# EasyEDA Pro project Buck.eprj

# Schematic Esquematico Buck
Board Name: BUCK; Create Date: 2025-07-01; Page Name: P1; Project Name: Buck; Schematic Name: Esquematico Buck; Update Date: 2025-07-13; Company: EasyEDA.com; Page Size: A4; Version: V1.0
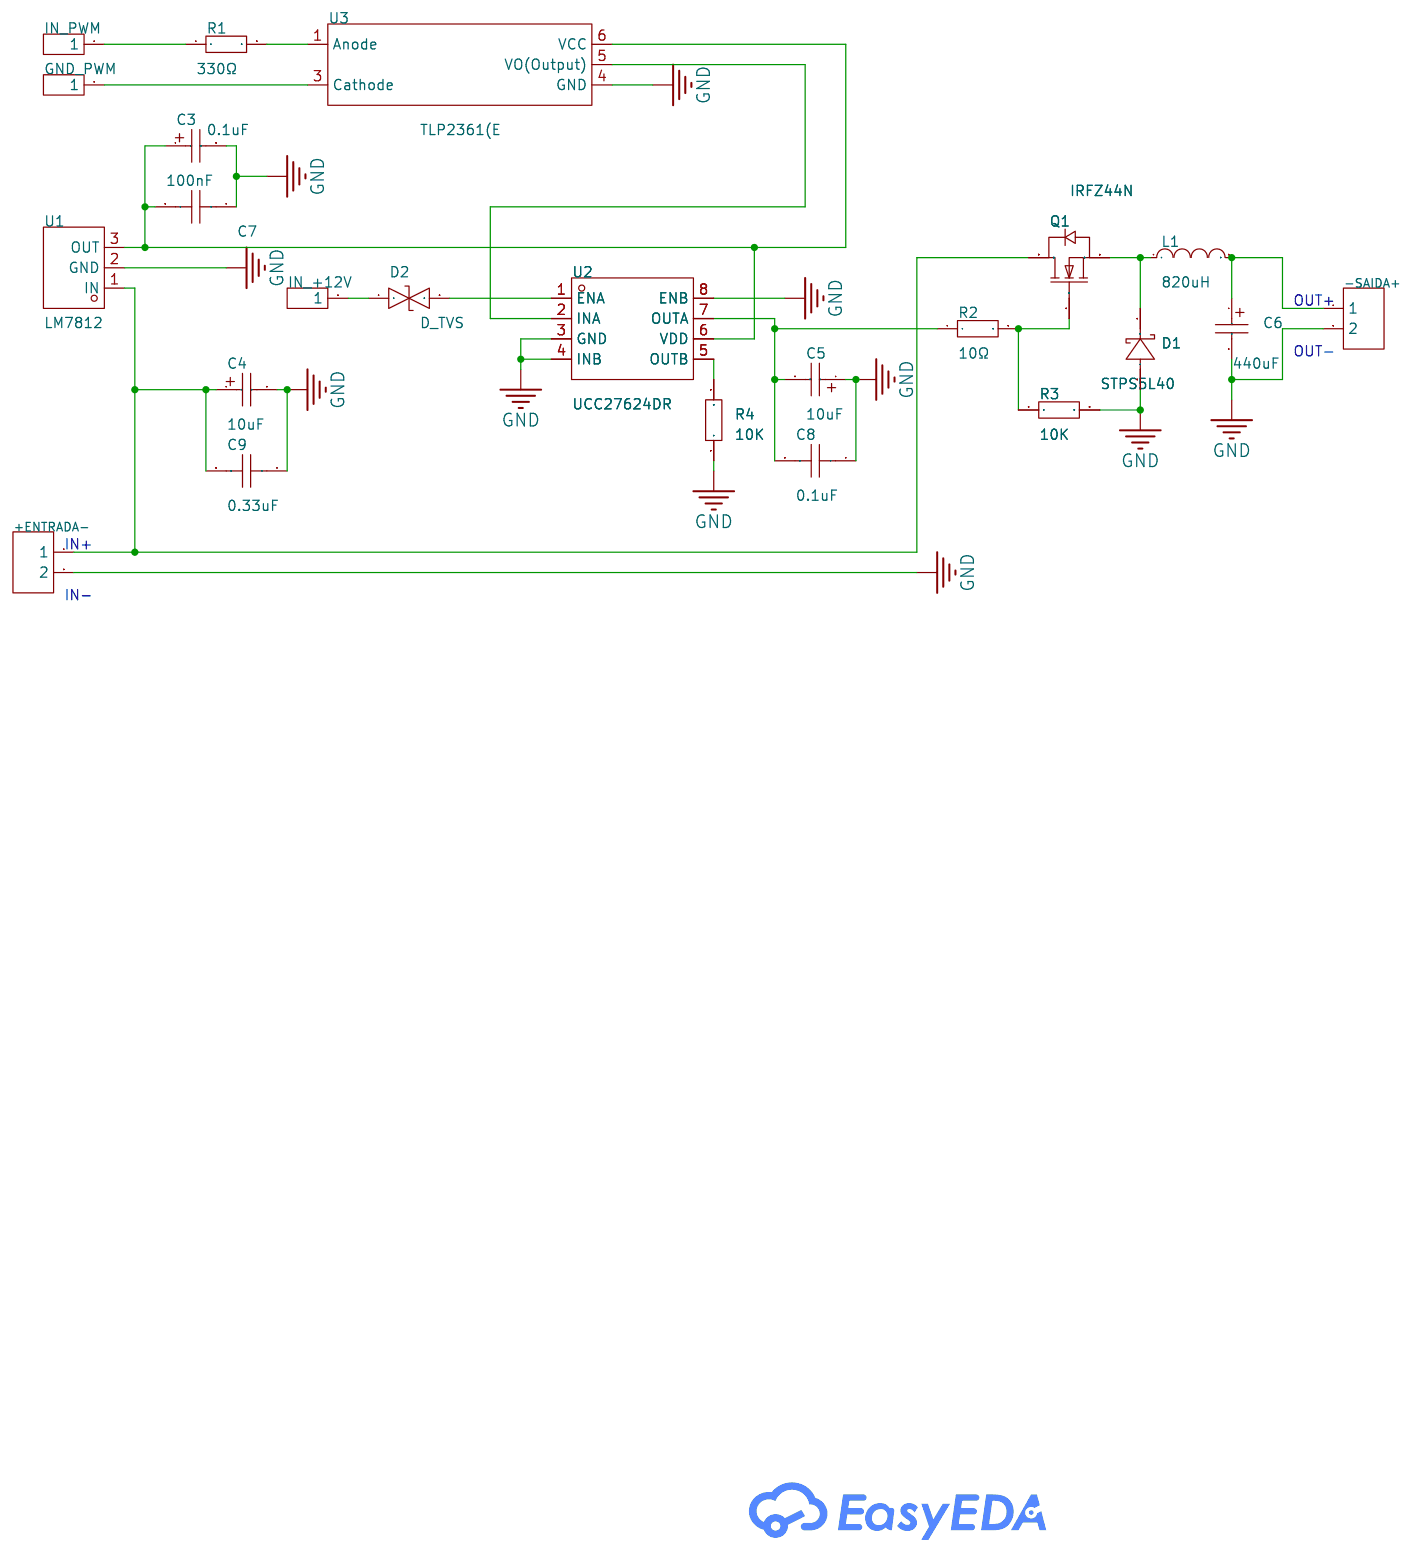
[diagram p0: schematic sheet]

## Parts
+ENTRADA-  -  [HDR-TH_2P-P2.54-V-F]
-SAIDA+  -  [HDR-TH_2P-P2.54-V-F]
C3  0.1uF  [CAP-SMD_BD3.0-L3.3-W3.3-RD]
C4  10uF  [CAP-SMD_BD3.0-L3.3-W3.3-RD]
C5  10uF  [CAP-SMD_BD3.0-L3.3-W3.3-RD]
C6  440uF  [CAP-SMD_BD3.0-L3.3-W3.3-RD]
C7  100nF  [C0201]
C8  0.1uF  [C0201]
C9  0.33uF  [C0201]
D1  STPS5L40  [DO-201AD_BD5.3-L9.5-P13.50-D1.4-RD]
D2  D_TVS  [SMB_L4.6-W3.6-LS5.3-BI]
GND_PWM  -  [HDR-TH_1P-V-M_XKB_X4611WV-01I-C28D40]
IN_+12V  -  [HDR-TH_1P-V-M_XKB_X4611WV-01I-C28D40]
IN_PWM  -  [HDR-TH_1P-V-M_XKB_X4611WV-01I-C28D40]
L1  820uH  [L1206]
Q1  IRFZ44N  [TO-220-3_L9.9-W4.5-P2.54-L]
R1  330 Ω  [R0603]
R2  10 Ω  [R0603]
R3  10K  [R0603]
R4  10K  [R0603]
U1  LM7812  [TO-263-3_L10.1-W9.0-P5.08-LS15.2-TL]
U2  UCC27624DR  [SOIC-8_L4.9-W3.9-P1.27-LS5.9-BL]
U3  TLP2361(E  [OPTO-SMD-5_L3.7-W4.6-P1.27-LS7.0-BR]

## Library data of the parts
+ENTRADA- -SAIDA+ = HDR-F_2.54_1x2P: Supplier Footprint: Through
C3-C6 = C_Ele_SMD_3x5.4mm: Supplier Footprint: SMD,3x5.4mm
C7-C9 = CAP_0201: Supplier Footprint: 0201
D1 = STPS5L40: LCSC Part Name: 电压:40V 电流:5A; Supplier Part: C2965232; Manufacturer: ST(意法半导体); Supplier Footprint: DO-201AD; JLCPCB Part Class: Extended Part; Datasheet: https://atta.szlcsc.com/upload/public/pdf/source/20191219/C472557_8126688719F2AFD7F9146EBFAB7586BB.pdf; Supplier: LCSC; Forward Voltage (Vf@If): 500mV@5A; Reverse Voltage (Vr): 40V; Rectified Current: 5A; Reverse Leakage Current (Ir): 200uA@40V
D2 = SMBJ36CA_C556189: LCSC Part Name: SMBJ36CA; Supplier Part: C556189; Manufacturer: Slkor(萨科微); Supplier Footprint: SMB(DO-214AA); JLCPCB Part Class: Extended Part; Datasheet: https://atta.szlcsc.com/upload/public/pdf/source/20200521/C556182_36C917246015907E450C16258F91715F.pdf; Supplier: LCSC; Reverse Stand-Off Voltage (Vrwm): 36V; Maximum Clamping Voltage: 58.1V; Peak Pulse Current (Ipp): 10.3A; Breakdown Voltage: 40V; Reverse Leakage Current (Ir): 5uA; Type: TVS
GND_PWM IN_+12V IN_PWM = HDR-M_2.54_1x1P: Supplier Footprint: Through
L1 = L_1206
Q1 = IRFZ44N: LCSC Part Name: 1个N沟道 耐压:60V 电流:60A; Supplier Part: C7429904; Manufacturer: minos(迈诺斯); Supplier Footprint: TO-220; JLCPCB Part Class: Extended Part; Datasheet: https://atta.szlcsc.com/upload/public/pdf/source/20240924/DFAFBF9B70D3F8B82D3192015D71E054.pdf; Supplier: LCSC; Number: 1 N-Channel; Drain to Source Voltage: 60V; Current - Continuous Drain(Id): 60A; RDS(on): 12mΩ@10V,25A; Pd - Power Dissipation: 87W; Gate Threshold Voltage (Vgs(th)@Id): 3V; Gate Charge(Qg): 31nC@10V; Input Capacitance(Ciss): 910pF@25V; Reverse Transfer Capacitance (Crss@Vds): 30pF@25V; Operating Temperature: -55℃~+175℃@(Tj)
R1-R4 = Res_0603: Supplier Footprint: 0603
U1 = LM7812: Supplier Part: C41366919; Manufacturer: YONGYUTAI(永裕泰); Supplier Footprint: TO-263; Datasheet: https://atta.szlcsc.com/upload/public/pdf/source/20240822/B1FEB2A08D0819A571124BFA06475AD1.pdf; Supplier: LCSC
U2 = UCC27624DR: Supplier Part: C3655293; Manufacturer: TI(德州仪器); Supplier Footprint: SOIC-8; JLCPCB Part Class: Extended Part; Datasheet: https://www.ti.com/cn/lit/gpn/ucc27624; Supplier: LCSC; Driven Configuration: Low Edge; Load Type: MOSFET; Number of Drivers: 2; Peak Output Current(sink): 5A; Peak Output Current(source): 5A; Supply Voltage: 4.5V~26V; Rise Time: 6ns; Fall Time: 10ns; Operating Temperature: -40℃~+150℃@(Tj)
U3 = TLP2361(E: Supplier Part: C6285467; Manufacturer: TOSHIBA(东芝); Supplier Footprint: SO-6,5LEAD; JLCPCB Part Class: Extended Part; Datasheet: https://atta.szlcsc.com/upload/public/pdf/source/20171211/C123773_15129612453461174243.pdf; Supplier: LCSC

## Nets
GND: +ENTRADA-.2 -SAIDA+.2 C3.2 C4.2 C5.1 C6.2 C7.1 C8.1 C9.1 D1.2(A) R3.2 R4.1 U1.2(GND) U2.3(GND) U2.4(INB) U2.8(ENB) U3.4(GND)
$1N479: -SAIDA+.1 C6.1 L1.2
$1N485: D1.1(C) L1.1 Q1.3(S)
$1N1360: U2.2(INA) U3.5(VO(Output))
$1N2621: R1.2 U3.1(Anode)
$1N2625: IN_PWM.1 R1.1
$1N3295: Q1.1(G) R2.2 R3.1
$1N3587: C3.1 C7.2 U1.3(OUT) U2.6(VDD) U3.6(VCC)
$1N3889: D2.2 U2.1(ENA)
$1N3901: D2.1 IN_+12V.1
$1N4438: +ENTRADA-.1 C4.1 C9.2 Q1.2(D) U1.1(IN)
$1N4462: C5.2 C8.2 R2.1 U2.7(OUTA)
$1N5931: R4.2 U2.5(OUTB)
Net-(GND_PWM-1): GND_PWM.1 U3.3(Cathode)

## Notes on the sheet
- OUT+
- OUT-
- IN+
- IN-

# Board PCB1
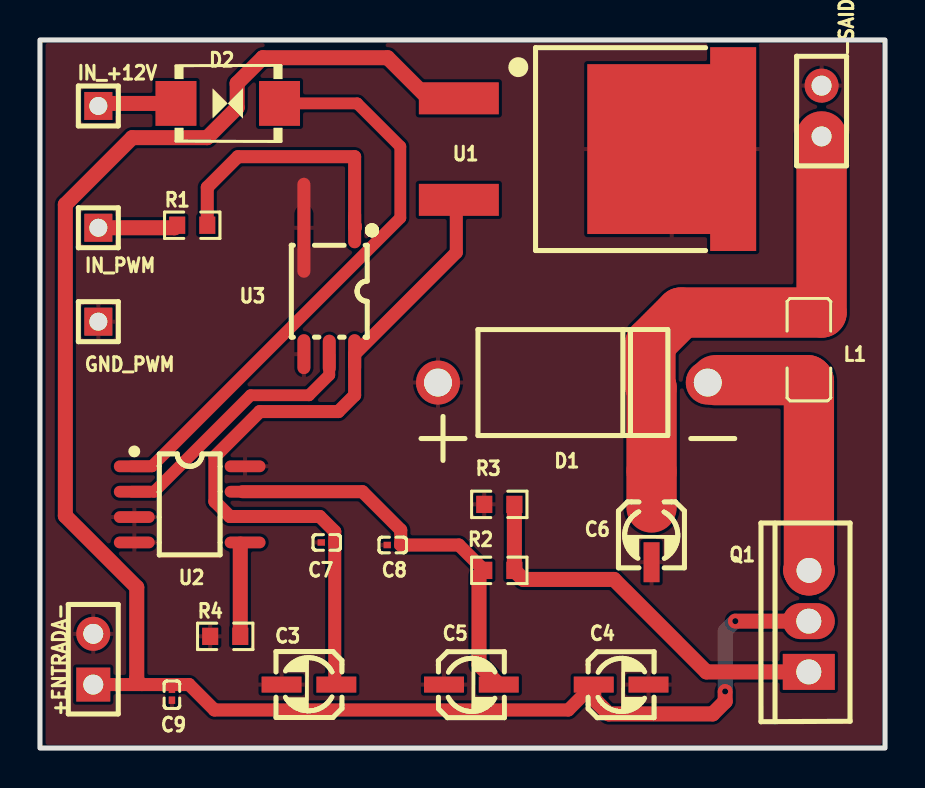
[diagram p1: board, top side]
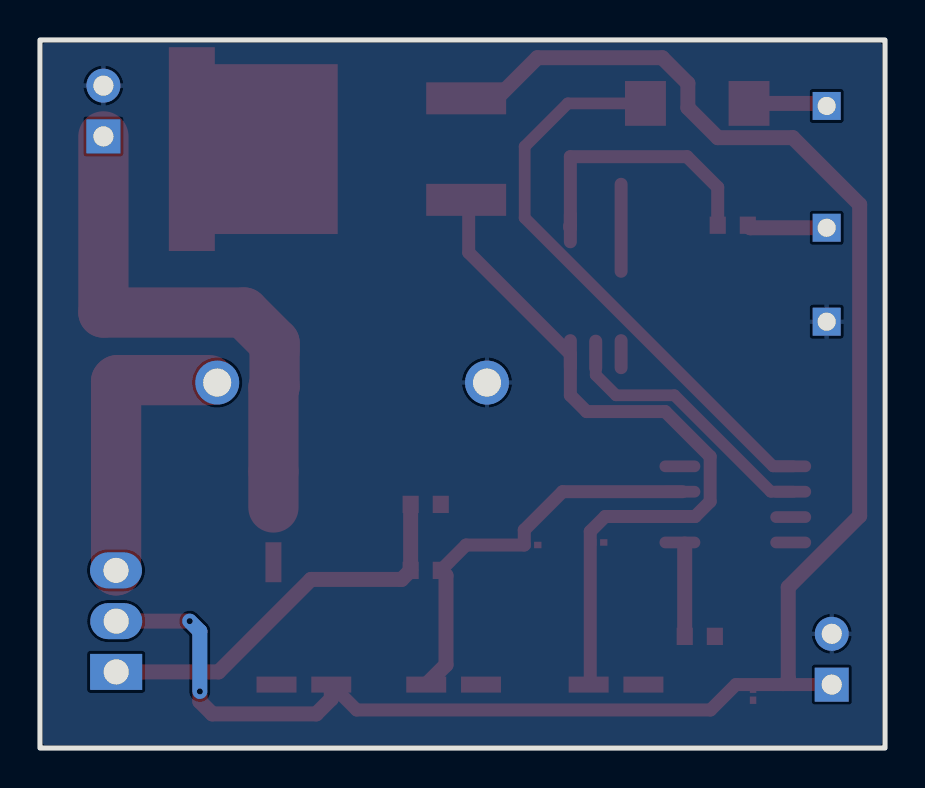
[diagram p2: board, bottom side, seen from below]

Outline 42.29 x 35.43 mm; copper layers: Top Layer, Bottom Layer. Coordinates in mm from the lower left corner of the outline.
Outline path: rectangle 0,35.43 42.29,0
Stack: Top Layer 0.035mm / Dielectric1 1.51mm FR4 er 4.5 / Bottom Layer 0.035mm

## Design rules (mm)
template: Custom Config
spacing copperThickness1oz (default): track to track 0.102, other pairs 0.152 to 0.3
spacing copperThickness2oz: track to track 0.203, other pairs 0.152 to 0.3
track width copperThickness1oz (default): min 0.254, default 0.75, max 2.54
track width copperThickness2oz: min 0.203, default 0.254, max 2.54
differential pair differentialPair (default): width min 0.127, default 0.254, max 2.54; gap min 0.152, default 0.152
via viaSize (default): diameter min 0.5, default 0.61, max 10; hole min 0.3, default 0.305, max 6.3

## Placement (name value [footprint] x y rotation side)
+ENTRADA-  -  [HDR-TH_2P-P2.54-V-F]  2.67 4.44 90 top
-SAIDA+  -  [HDR-TH_2P-P2.54-V-F]  39.12 31.88 90 top
C3  0.1uF  [CAP-SMD_BD3.0-L3.3-W3.3-RD]  13.46 3.17 0 top
C4  10uF  [CAP-SMD_BD3.0-L3.3-W3.3-RD]  29.08 3.17 180 top
C5  10uF  [CAP-SMD_BD3.0-L3.3-W3.3-RD]  21.59 3.17 180 top
C6  440uF  [CAP-SMD_BD3.0-L3.3-W3.3-RD]  30.61 10.67 90 top
C7  100nF  [C0201]  14.35 10.29 0 top
C8  0.1uF  [C0201]  17.65 10.16 0 top
C9  0.33uF  [C0201]  6.6 2.67 90 top
D1  STPS5L40  [DO-201AD_BD5.3-L9.5-P13.50-D1.4-RD]  26.67 18.29 180 top
D2  D_TVS  [SMB_L4.6-W3.6-LS5.3-BI]  9.4 32.26 0 top
GND_PWM  -  [HDR-TH_1P-V-M_XKB_X4611WV-01I-C28D40]  2.92 21.34 0 top
IN_+12V  -  [HDR-TH_1P-V-M_XKB_X4611WV-01I-C28D40]  2.92 32.13 0 top
IN_PWM  -  [HDR-TH_1P-V-M_XKB_X4611WV-01I-C28D40]  2.92 26.03 0 top
L1  820uH  [L1206]  38.48 19.94 90 top
Q1  IRFZ44N  [TO-220-3_L9.9-W4.5-P2.54-L]  38.48 6.35 90 top
R1  330 Ω  [R0603]  7.62 26.16 0 top
R2  10 Ω  [R0603]  22.99 8.89 0 top
R3  10K  [R0603]  22.99 12.19 180 top
R4  10K  [R0603]  9.27 5.59 0 top
U1  LM7812  [TO-263-3_L10.1-W9.0-P5.08-LS15.2-TL]  26.29 29.97 0 top
U2  UCC27624DR  [SOIC-8_L4.9-W3.9-P1.27-LS5.9-BL]  7.49 12.19 270 top
U3  TLP2361(E  [OPTO-SMD-5_L3.7-W4.6-P1.27-LS7.0-BR]  14.48 22.86 90 top

## Footprints (pads in the part's own frame, mm; a bottom-side part is the same pattern mirrored in y, then rotated)
C0201
  rect 0.368x0.324 smd: 1(-0.275,0) 2(0.275,0)
CAP-SMD_BD3.0-L3.3-W3.3-RD
  rect 2x0.8 smd: 1(1.37,0) 2(-1.37,0)
DO-201AD_BD5.3-L9.5-P13.50-D1.4-RD
  round 2.2 hole 1.4: 1(-6.75,0) 2(6.75,0)
HDR-TH_1P-V-M_XKB_X4611WV-01I-C28D40
  rect 1.4x1.4 hole 0.9: 1(0,0)
HDR-TH_2P-P2.54-V-F
  rect 1.7x1.7 hole 1: 1(-1.27,0)
  round 1.7 hole 1: 2(1.27,0)
L1206
  rect 1.485x1.728 smd: 1(-1.593,0) 2(1.593,0)
OPTO-SMD-5_L3.7-W4.6-P1.27-LS7.0-BR
  oval 2x0.65 smd: 1(3.15,-1.27) 4(-3.15,1.27) 5(-3.175,0) 6(-3.15,-1.27)
  oval 5x0.65 smd: 3(3.175,1.27)
R0603
  rect 0.806x0.864 smd: 1(-0.753,0) 2(0.753,0)
SMB_L4.6-W3.6-LS5.3-BI
  rect 2.047x2.241 smd: 1(-2.591,0) 2(2.591,0)
SOIC-8_L4.9-W3.9-P1.27-LS5.9-BL
  oval 0.588x2.045 smd: 1(-1.905,-2.772) 2(-0.635,-2.772) 3(0.635,-2.772) 4(1.905,-2.772) 5(1.905,2.772) 6(0.635,2.772) 7(-0.635,2.772) 8(-1.905,2.772)
TO-220-3_L9.9-W4.5-P2.54-L
  rect 1.8x2.6 hole 1.25: 1(-2.54,0.005)
  oval 1.8x2.6 hole 1.25: 2(0,0.005) 3(2.54,-0.005)
TO-263-3_L10.1-W9.0-P5.08-LS15.2-TL
  rect 4x1.6 smd: 1(-5.327,2.54) 3(-5.327,-2.54)
  custom 8.45x10.2 smd: 2(5.327,0)

## Nets
As in the schematic, except:
GND: +ENTRADA-.2 -SAIDA+.2 C3.2 C4.2 C5.1 C6.2 C7.1 C8.1 C9.1 D1.2 GND_PWM.1 R3.2 R4.1 U1.2 U2.3 U2.4 U2.8 U3.3 U3.4

## Via types
v1: diameter 0.61, hole 0.305, Top Layer to Bottom Layer, 2 vias

## Routing (per net, layer and track width the routed paths; a pad name or vN(x,y) marks a point on that pad's centre or on a via; arc(x,y) is an arc through that point)
$1N479: length 34.1
  Top Layer w0.75: C6.1 30.62,12.05 30.61,13.84 30.57,18.08 30.55,19.89
  Top Layer w2.514: 30.55,19.89 30.55,18.09 30.61,18.04 C6.1
  Top Layer w2.515: -SAIDA+.1 39.12,21.79 32.08,21.79 30.55,20.26 30.55,19.89
$1N485: length 14.2
  Top Layer w2.515: Q1.3 38.48,8.89 L1.1 38.42,18.41 33.81,18.41
$1N1360: length 13.3
  Top Layer w0.588: 14.48,19.68 14.48,18.67 13.46,17.65 10.54,17.65 5.71,12.83 4.59,12.83
$1N2621: length 13.5
  Top Layer w0.65: R1.2 8.37,28.06 9.91,29.59 15.75,29.59 15.75,26.16 15.77,26.14 15.77,26.03 U3.1
$1N2625: length 4
  Top Layer w0.75: IN_PWM.1 6.74,26.03 R1.1
$1N3295: length 20.2
  Top Layer w0.75: R3.1 R2.2 24.19,8.44 28.73,8.44 33.35,3.81 38.35,3.81 38.48,3.94
$1N3587: length 36.8
  Top Layer w0.324: 10.17,11.59 10.14,11.56
  Top Layer w0.65: C3.1 14.75,3.25 14.75,10.84 14,11.59 9.5,11.59 8.75,12.34 8.75,14.59 11,16.84 14.93,16.84 15.75,17.65 U3.6 20.83,24.8 20.83,27.43
$1N3889: length 29.1
  Top Layer w0.588: D2.2 15.88,32.26 18.03,30.1 18.03,26.53 5.6,14.1 4.59,14.1
$1N3901: length 4.2
  Top Layer w0.75: D2.1 2.92,32.26 2.79,32.13 IN_+12V.1
$1N4438: length 91.7
  Top Layer w0.65: 5.1,3.17 +ENTRADA-.1 ; 5.1,3.17 5.1,3.18 4.79,3.49 4.84,3.54 ; 5.1,3.17 7.46,3.17 8.73,1.9 26.44,1.9 C4.1
  Top Layer w0.75: 4.84,3.54 4.84,8.04 1.27,11.62 1.27,27.2 4.62,30.54 8.37,30.54 9.87,32.04 9.87,33.26 11.15,34.54 17.4,34.54 19.43,32.51 20.83,32.51 ; v1(34.29,2.83) 34.29,2.33 33.67,1.71 28.46,1.71 27.71,2.46 C4.1 ; v1(34.8,6.35) Q1.2
  Bottom Layer w0.75: v1(34.29,2.83) 34.29,5.84 v1(34.8,6.35)
$1N4462: length 20.4
  Top Layer w0.65: 10.14,12.83 16.14,12.83 18.05,10.91 18.05,10.16 20.96,10.16 R2.1
  Top Layer w0.75: R2.1 21.97,8.63 21.97,4.16 C5.2
$1N5931: length 4.6
  Top Layer w0.75: 10.02,10.21 R4.2

## Copper pours and planes (outline as drawn; the poured copper is in the pictures)
GND on Top Layer: 0.38,35.43 42.67,35.43 42.67,0 0.38,0
GND on Bottom Layer: 0,35.43 42.29,35.43 42.29,0 0,0
GND on Bottom Layer: 0.25,35.43 42.29,35.43 42.29,0 0.25,0
